# EAGLE design Qwiic LED Stick (EAGLE 9.0.1)
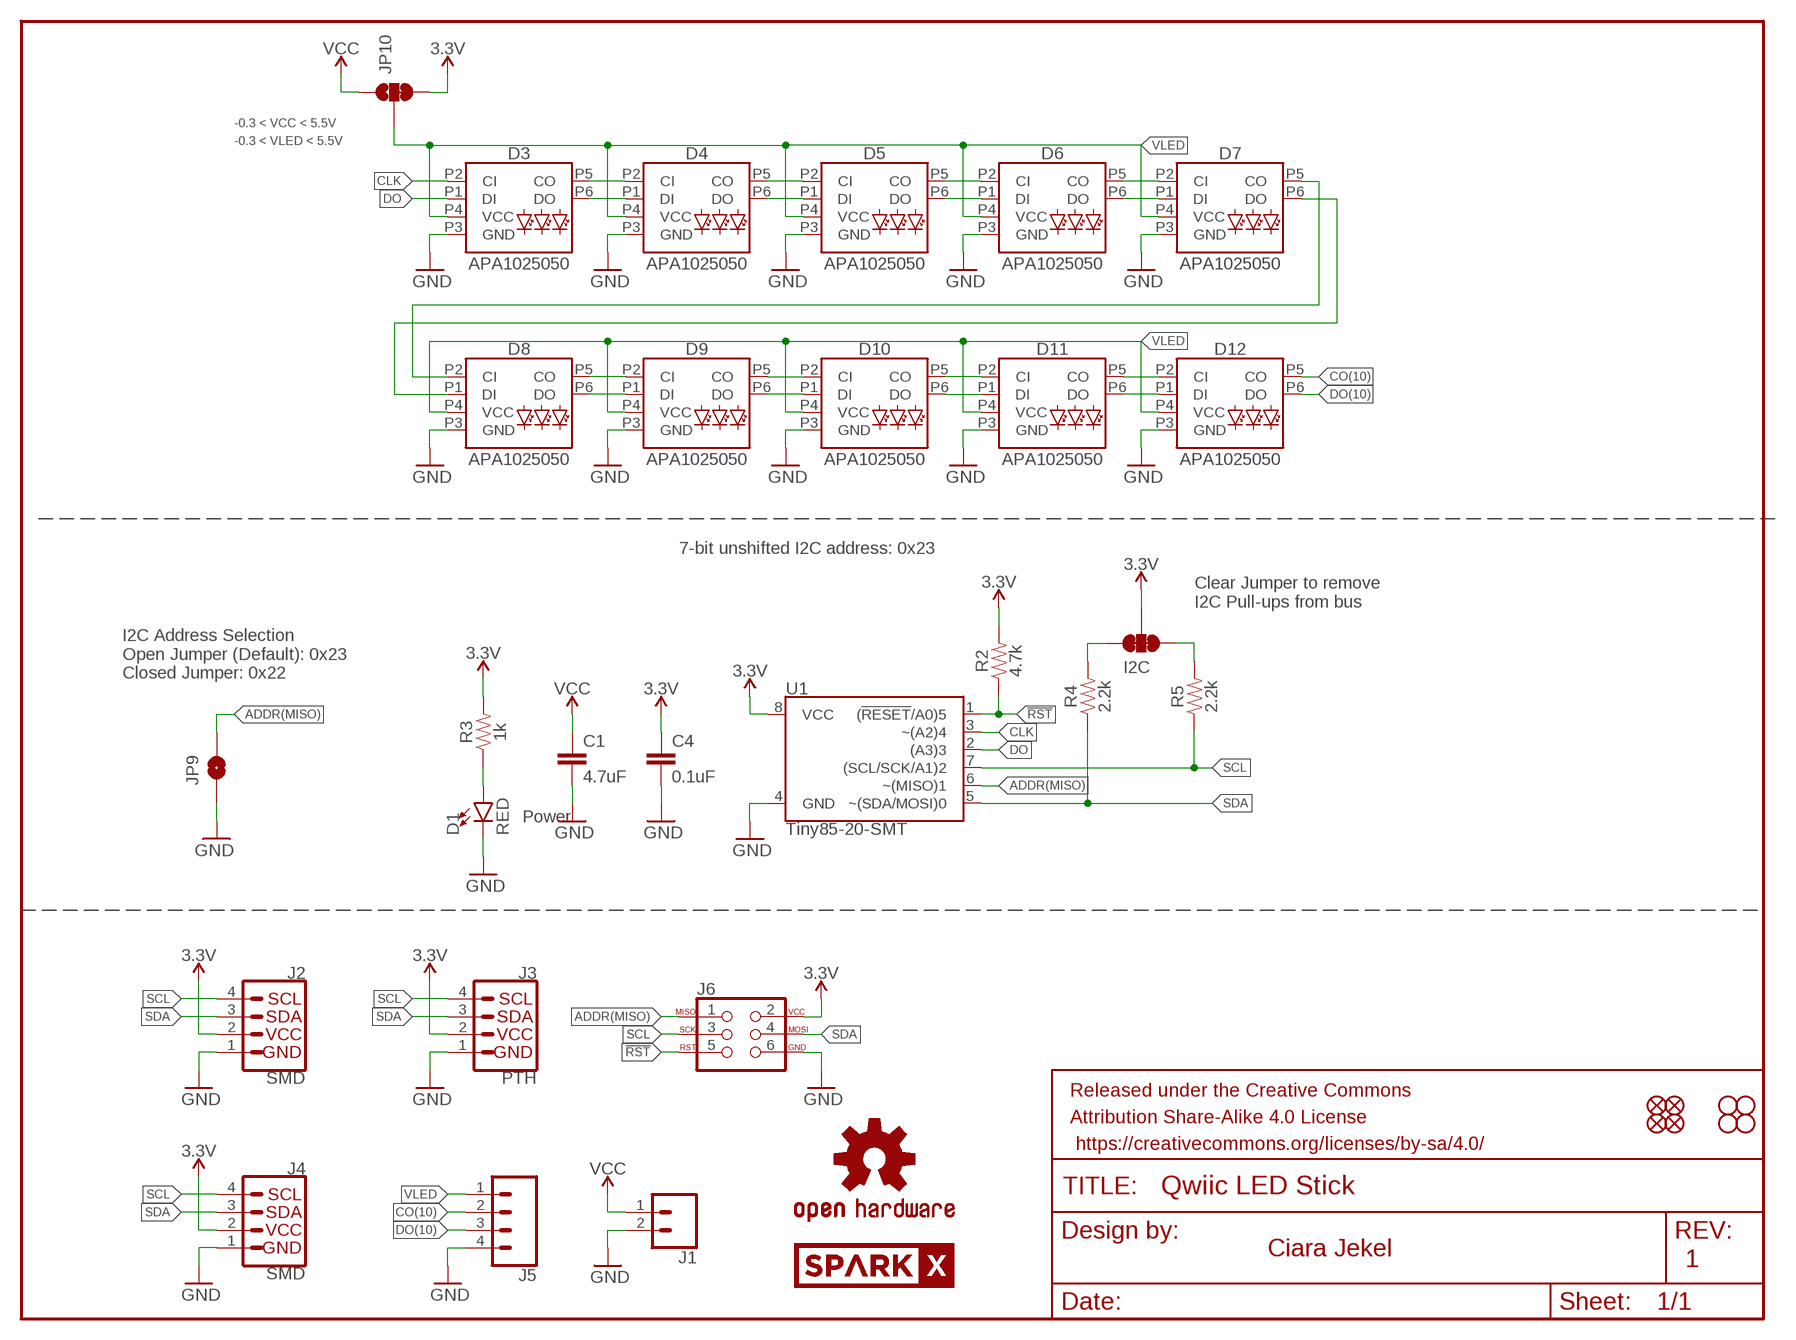
[diagram p0: schematic, sheet 1]

## Parts
C1  4.7uF  4.7UF-0603-6.3V-(10%)  [0603]
C4  0.1uF  0.1UF-0603-25V-(+80/-20%)  [0603]
D1  RED  LED-RED0603  [LED-0603]
D3  APA1025050  [APA102-5050]
D4  APA1025050  [APA102-5050]
D5  APA1025050  [APA102-5050]
D6  APA1025050  [APA102-5050]
D7  APA1025050  [APA102-5050]
D8  APA1025050  [APA102-5050]
D9  APA1025050  [APA102-5050]
D10  APA1025050  [APA102-5050]
D11  APA1025050  [APA102-5050]
D12  APA1025050  [APA102-5050]
FRAME1  FRAME-LETTER  [CREATIVE_COMMONS]
I2C  JUMPER-SMT_3_2-NC_TRACE_SILK  [SMT-JUMPER_3_2-NC_TRACE_SILK]
J1  CONN_021X02_NO_SILK  [1X02_NO_SILK]
J2  SMD  I2C_STANDARDJS-1MM  [1X04_1MM_RA]
J3  PTH  I2C_STANDARD_NO_SILK  [1X04_NO_SILK]
J4  SMD  I2C_STANDARDJS-1MM  [1X04_1MM_RA]
J5  CONN_041X04_NO_SILK  [1X04_NO_SILK]
J6  AVR_SPI_PROG_3X2TESTPOINTS  [2X3_TEST_POINTS]
JP1  FIDUCIALUFIDUCIAL  [MICRO-FIDUCIAL]
JP2  FIDUCIALUFIDUCIAL  [MICRO-FIDUCIAL]
JP3  STAND-OFF  [STAND-OFF]
JP4  STAND-OFF  [STAND-OFF]
JP5  FIDUCIALUFIDUCIAL  [MICRO-FIDUCIAL]
JP6  FIDUCIALUFIDUCIAL  [MICRO-FIDUCIAL]
JP7  STAND-OFF  [STAND-OFF]
JP8  STAND-OFF  [STAND-OFF]
JP9  JUMPER-SMT_2_NO_SILK  [SMT-JUMPER_2_NO_SILK]
JP10  JUMPER-SMT_3_1-NC_TRACE_SILK  [SMT-JUMPER_3_1-NC_TRACE_SILK]
LOGO1  OSHW-LOGOMINI  [OSHW-LOGO-MINI]
R2  4.7k  4.7KOHM-0603-1/10W-1%  [0603]
R3  1k  1KOHM-0603-1/10W-1%  [0603]
R4  2.2k  2.2KOHM-0603-1/10W-1%  [0603]
R5  2.2k  2.2KOHM-0603-1/10W-1%  [0603]
U1  Tiny85-20-SMT  ATTINY85-ARDUINOTINY85-20-SMT  [SO08-EIAJ_MCU]
U$1  SPARKX-LOGO4  [SPARKX-MEDIUM]
U$2  SPARKX-LOGO4  [SPARKX-MEDIUM]

## Nets
3.3V: C4.1 I2C.2 J2.2(VCC) J3.2(VCC) J4.2(VCC) J6.2 JP10.3 R2.2 R3.2 U1.8(VCC)
!RST: J6.5 R2.1 U1.1((!RESET!/A0)5)
ADDR(MISO): J6.1 JP9.2 U1.6(~(MISO)1)
CLK: D3.P2(CI) U1.3(~(A2)4)
CO(10): D12.P5(CO) J5.2
DO: D3.P1(DI) U1.2((A3)3)
DO(10): D12.P6(DO) J5.3
GND: C1.2 C4.2 D1.C D3.P3(GND) D4.P3(GND) D5.P3(GND) D6.P3(GND) D7.P3(GND) D8.P3(GND) D9.P3(GND) D10.P3(GND) D11.P3(GND) D12.P3(GND) J1.2 J2.1(GND) J3.1(GND) J4.1(GND) J5.4 J6.6 JP9.1 U1.4(GND)
N$1: I2C.1 R5.2
N$2: I2C.3 R4.2
N$3: D1.A R3.1
N$8: D11.P6(DO) D12.P1(DI)
N$9: D11.P5(CO) D12.P2(CI)
N$10: D10.P5(CO) D11.P2(CI)
N$11: D10.P6(DO) D11.P1(DI)
N$12: D9.P5(CO) D10.P2(CI)
N$13: D9.P6(DO) D10.P1(DI)
N$14: D8.P5(CO) D9.P2(CI)
N$15: D8.P6(DO) D9.P1(DI)
N$16: D7.P5(CO) D8.P2(CI)
N$17: D7.P6(DO) D8.P1(DI)
N$18: D6.P5(CO) D7.P2(CI)
N$19: D6.P6(DO) D7.P1(DI)
N$20: D5.P6(DO) D6.P1(DI)
N$21: D5.P5(CO) D6.P2(CI)
N$22: D4.P6(DO) D5.P1(DI)
N$23: D4.P5(CO) D5.P2(CI)
N$24: D3.P5(CO) D4.P2(CI)
N$25: D3.P6(DO) D4.P1(DI)
SCL: J2.4(SCL) J3.4(SCL) J4.4(SCL) J6.3 R5.1 U1.7((SCL/SCK/A1)2)
SDA: J2.3(SDA) J3.3(SDA) J4.3(SDA) J6.4 R4.1 U1.5(~(SDA/MOSI)0)
VCC: C1.1 J1.1 JP10.1
VLED: D3.P4(VCC) D4.P4(VCC) D5.P4(VCC) D6.P4(VCC) D7.P4(VCC) D8.P4(VCC) D9.P4(VCC) D10.P4(VCC) D11.P4(VCC) D12.P4(VCC) J5.1 JP10.2

## Notes on the sheet
- -0.3 < VCC < 5.5V
- -0.3 < VLED < 5.5V
- 7-bit unshifted I2C address: 0x23
- Clear Jumper to remove 
  I2C Pull-ups from bus
- I2C Address Selection
  Open Jumper (Default): 0x23
  Closed Jumper: 0x22
- Power
- Ciara Jekel
- 1

## Library data of the parts
C1 = SparkFun-Capacitors:4.7UF: 4.7µF ceramic capacitors A capacitor is a passive two-terminal electrical component used to store electrical energy temporarily in an electric field.; PROD_ID: CAP-08280
C4 = SparkFun-Capacitors:0.1UF: 0.1µF ceramic capacitors A capacitor is a passive two-terminal electrical component used to store electrical energy temporarily in an electric field.; PROD_ID: CAP-00810
D1 = SparkFun-LED:LED-RED: Red SMD LED Used in manufacturing of most products at SparkFun Packages: 0603 - SMD 0603 package [Product Link] <http://docs.avagotech.com/docs/AV02-0551EN> 0603 SMART - SMD 0603 SMART package ( more efficient and expensive)[Product Link] <http://www.osram-os.com/Graphics/XPic2/00077099_0.pdf> 1206 - SMD1206 package [Product Link] <https://www.sparkfun.com/datasheets/DevTools/LilyPad/Q150OVS4.pdff> SparkFun Products: Pro Mini 328 -5V <https://www.sparkfun.com/products/821> RedBoard <https://www.sparkfun.com/products/12757> IOIO-OTG <https://www.sparkfun.com/products/13613>; PROD_ID: DIO-00819
D3-D12 = SparkFun-LED:APA102: APA102 Addressable RGB LED Used in manufacturing of various products at SparkFun Packages: 5050 2020 SparkFun Products: SparkFun Lumenati Boards <https://www.sparkfun.com/categories/405>; PROD_ID: DIO-13739
FRAME1 = SparkFun-Aesthetics:FRAME-LETTER: Schematic Frame - Letter Standard 8.5x11 US Letter frame
I2C = SparkFun-Jumpers:JUMPER-SMT_3_2-NC_TRACE: Normally closed trace jumper (2 of 2 connections) This jumper has a trace between all three pads so they are normally closed (NC). Use a razor knife to open the connection(s). For best results follow the IPC guidelines for cutting traces: Cutout at least 0.063 mm (0.005 in). Remove all loose material to clean up the cut area. Seal the cut with an approved epoxy. Reapply solder to reclose the connection(s).
J1 = SparkFun-Connectors:CONN_02: Multi connection point. Often used as Generic Header-pin footprint for 0.1 inch spaced/style header connections On any of the 0.1 inch spaced packages, you can populate with these: Break Away Headers - Straight <https://www.sparkfun.com/products/116> (PRT-00116) Break Away Male Headers - Right Angle <https://www.sparkfun.com/products/553> (PRT-00553) Female Headers <https://www.sparkfun.com/products/115> (PRT-00115) Break Away Headers - Machine Pin <https://www.sparkfun.com/products/117> (PRT-00117) Break Away Female Headers - Swiss Machine Pin <https://www.sparkfun.com/products/743> (PRT-00743) For SCREWTERMINALS and SPRING TERMINALS visit here: Screw Terimnals on SparkFun.com <https://www.sparkfun.com/search/results?term=Screw+Terminals> (5mm/3.5mm/2.54mm spacing) This device is also useful as a general connection point to wire up your design to another part of your project. Our various solder wires solder well into these plated through hole pads. Hook-Up Wire - Assortment (Stranded, 22 AWG) <https://www.sparkfun.com/products/11375> (PRT-11375) Hook-Up Wire - Assortment (Solid Core, 22 AWG) <https://www.sparkfun.com/products/11367> (PRT-11367) View the entire wire category on our website here <https://www.sparkfun.com/categories/141> Special notes: Molex polarized connector foot print use with: PRT-08233 with associated crimp pins and housings. 2.54_SCREWTERM for use with PRT-10571. 3.5mm Screw Terminal footprints for PRT-08084 5mm Screw Terminal footprints for use with PRT-08432
J2-J4 = SparkX:I2C_STANDARD: SparkFun I2C Standard Pinout Header SparkFun has standardized on a pinout for all I2C based sensor breakouts. This pinout allows I2C boards to be plugged directly into the headers on Arduino Uno compatible boards, and to be daisy chained easily. Example SparkFun Products: SparkFun Atmospheric Sensor Breakout - BME280 <https://www.sparkfun.com/products/13676> SparkFun Altitude/Pressure Sensor Breakout - MPL3115A2 <https://www.sparkfun.com/products/11084> SparkFun TOF Range Finder Sensor - VL6180 <https://www.sparkfun.com/products/12785>
J5 = SparkFun-Connectors:CONN_04: Multi connection point. Often used as Generic Header-pin footprint for 0.1 inch spaced/style header connections On any of the 0.1 inch spaced packages, you can populate with these: Break Away Headers - Straight <https://www.sparkfun.com/products/116> (PRT-00116) Break Away Male Headers - Right Angle <https://www.sparkfun.com/products/553> (PRT-00553) Female Headers <https://www.sparkfun.com/products/115> (PRT-00115) Break Away Headers - Machine Pin <https://www.sparkfun.com/products/117> (PRT-00117) Break Away Female Headers - Swiss Machine Pin <https://www.sparkfun.com/products/743> (PRT-00743) For SCREWTERMINALS and SPRING TERMINALS visit here: Screw Terimnals on SparkFun.com <https://www.sparkfun.com/search/results?term=Screw+Terminals> (5mm/3.5mm/2.54mm spacing) This device is also useful as a general connection point to wire up your design to another part of your project. Our various solder wires solder well into these plated through hole pads. Hook-Up Wire - Assortment (Stranded, 22 AWG) <https://www.sparkfun.com/products/11375> (PRT-11375) Hook-Up Wire - Assortment (Solid Core, 22 AWG) <https://www.sparkfun.com/products/11367> (PRT-11367) View the entire wire category on our website here <https://www.sparkfun.com/categories/141> Special notes: Molex polarized connector foot print use with SKU : PRT-08231 with associated crimp pins and housings. 1MM SMD Version SKU: PRT-10208; PROD_ID: CONN-09696
J6 = SparkFun-Connectors:AVR_SPI_PROG_3X2: AVR ISP 6 Pin This is the reduced ISP connector for AVR programming. Common on Arduino. This footprint will take up less PCB space and can be used with a 10-pin to 6-pin adapter such as SKU: BOB-08508 **Special note about "TEST_POINT" package. The stop mask is on the top side, so if you want your programming test points to be on the bottom of your board, make sure to place this package on the bottom side of the board. This also ensure that the orientation to program from the bottom side will be correct. SparkFun Products: SparkFun ISP Pogo Adapter <https://www.sparkfun.com/products/11591> - NS Tiny AVR Programmer <https://www.sparkfun.com/products/11801> -PTH
JP1 JP2 JP5 JP6 = SparkFun:FIDUCIAL: Fiducial Alignment Points Various fiducial points for machine vision alignment.
JP3 JP4 JP7 JP8 = SparkFun:STAND-OFF: Stand Off This is the mechanical footprint for a #4 phillips button head screw. Use the keepout ring to avoid running the screw head into surrounding components. SKU : PRT-00447
JP9 = SparkFun-Jumpers:JUMPER-SMT_2_NO: Normally open jumper This jumper has two pads in close proximity to each other. Apply solder to close the connection. Round pads are easier to solder for beginners, but are a lot larger. SparkFun Product that uses the round pads: SparkFun EL Sequencer <https://www.sparkfun.com/products/12781>
JP10 = SparkFun-Jumpers:JUMPER-SMT_3_1-NC_TRACE: Normally closed trace jumper (1 of 2 connections) This jumper has a trace between two pads so it's normally closed (NC). The other connection is normally open (NO). Use a razor knife to open the connection. For best results follow the IPC guidelines for cutting traces: Cutout at least 0.063 mm (0.005 in). Remove all loose material to clean up the cut area. Seal the cut with an approved epoxy. Reapply solder to reclose the connection, or to close the NO connection.
LOGO1 = SparkFun-Aesthetics:OSHW-LOGO: Open-Source Hardware (OSHW) Logo This logo indicates the piece of hardware it is found on incorporates a OSHW license and/or adheres to the definition of open source hardware found here: http://freedomdefined.org/OSHW
R2 = SparkFun-Resistors:4.7KOHM: 4.7kΩ resistor A resistor is a passive two-terminal electrical component that implements electrical resistance as a circuit element. Resistors act to reduce current flow, and, at the same time, act to lower voltage levels within circuits. - Wikipedia; PROD_ID: RES-07857
R3 = SparkFun-Resistors:1KOHM: 1kΩ resistor A resistor is a passive two-terminal electrical component that implements electrical resistance as a circuit element. Resistors act to reduce current flow, and, at the same time, act to lower voltage levels within circuits. - Wikipedia; PROD_ID: RES-07856
R4 R5 = SparkFun-Resistors:2.2KOHM: 2.2kΩ resistor A resistor is a passive two-terminal electrical component that implements electrical resistance as a circuit element. Resistors act to reduce current flow, and, at the same time, act to lower voltage levels within circuits. - Wikipedia; PROD_ID: RES-08272
U1 = Qwiic-Bluetooth-HC1x:ATTINY85-ARDUINO: Atmel 8-pin 2/4/8kB flash uC; PROD_ID: IC-09092
U$1 U$2 = SparkX:SPARKX-LOGO

## Net classes
1 power: width 0.203 mm

## Board
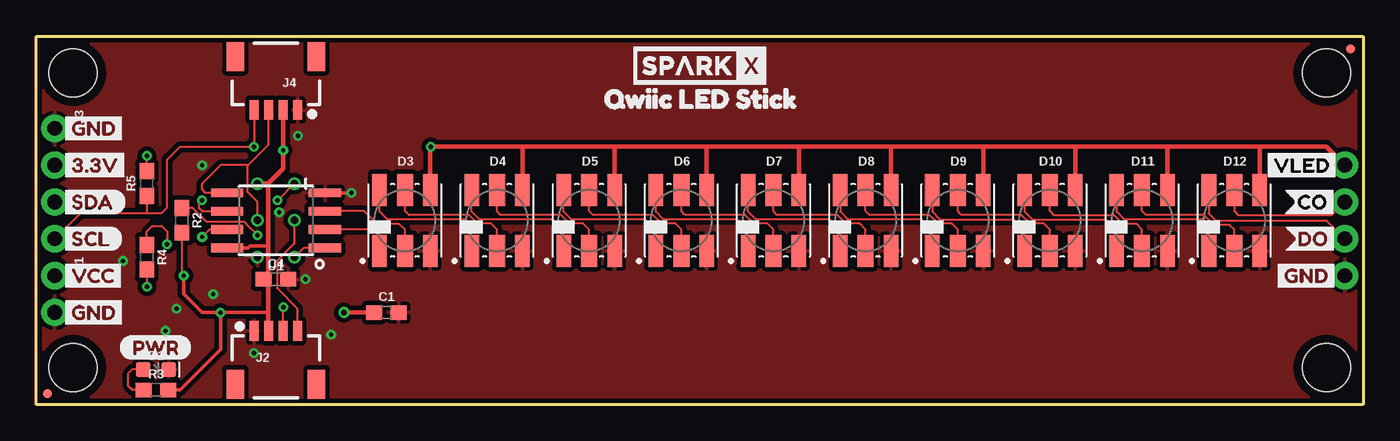
[diagram p1: board, top side]
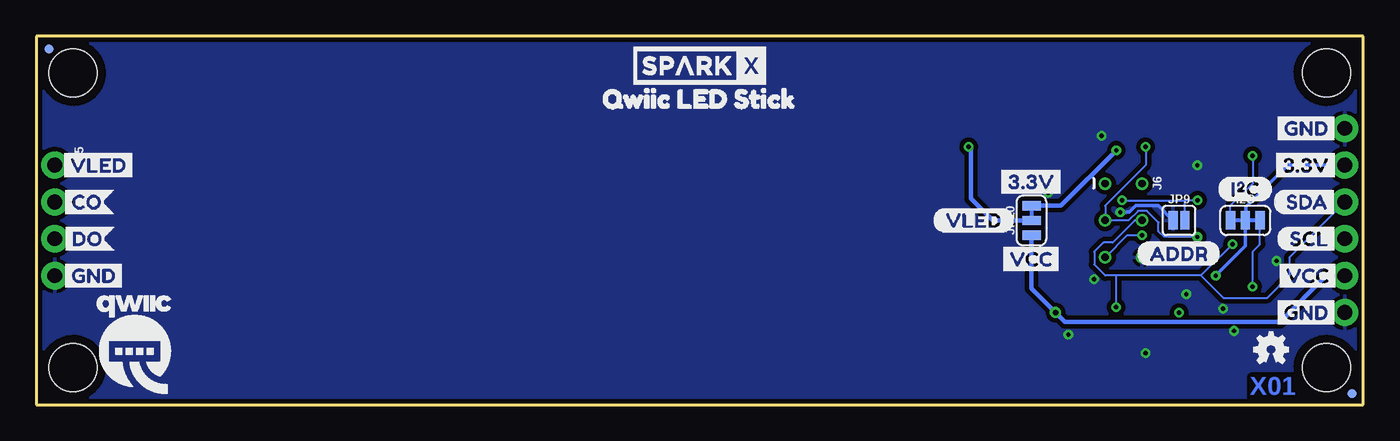
[diagram p2: board, bottom side, seen from below]

Size 91.44 x 25.4 mm. Coordinates in mm from the lower left corner, seen from the top.
Outline: 91.44,0 0,0 0,25.4 91.44,25.4 91.44,0
Copper layers (1*16): Top 0.035mm / dielectric 1.5mm / Bottom 0.035mm
Design rules "SparkFun-2-layer-PCBWay-LIMIT": minimum track width 6mil, minimum drill 0.3mm, track to track 6mil, track to pad 6mil, pad to pad 6mil, via to via 6mil, smd to smd 6mil, copper to edge 6mil, drill to drill 6mil, minimum pad ring 7mil, minimum via ring 7mil, stop-mask expansion 4mil, vias tented up to drill 25mil, thermal gap 10mil

### Footprints (pad centres in the part's own frame; a part is rotated, then mirrored left to right if it is on the bottom)
0603 = smd 1.1 x 1: 1 -0.85,0; 2 0.85,0
LED-0603 = smd 1 x 1: A -0.877,0; C 0.877,0
APA102-5050 = smd 1 x 2.2: P1 -1.75,-2.1; P3 1.75,-2.1; P4 1.75,2.1; P6 -1.75,2.1 | smd 1.1 x 2.2: P2 0,-2.1; P5 0,2.1
SMT-JUMPER_3_2-NC_TRACE_SILK = smd 0.635 x 1.27: 1 -1.016,0; 2 0,0; 3 1.016,0
1X02_NO_SILK = drill 1.016 pad 1.88: 1 0,0; 2 2.54,0
1X04_1MM_RA = smd 0.6 x 1.35: 1 -1.5,0; 2 -0.5,0; 3 0.5,0; 4 1.5,0 | smd 1.2 x 2: NC1 2.8,-3.675; NC2 -2.8,-3.675
1X04_NO_SILK = drill 1.016 pad 1.88: 1 0,0; 2 2.54,0; 3 5.08,0; 4 7.62,0
2X3_TEST_POINTS = drill 0.508: 1 -2.54,-1.27; 2 -2.54,1.27; 3 0,-1.27; 4 0,1.27; 5 2.54,-1.27; 6 2.54,1.27
MICRO-FIDUCIAL = smd 0.635 x 0.635: 1 0,0
STAND-OFF = hole 3.302: 0,0
SMT-JUMPER_2_NO_SILK = smd 0.635 x 1.27: 1 -0.406,0; 2 0.406,0
SMT-JUMPER_3_1-NC_TRACE_SILK = smd 0.635 x 1.27: 1 -1.016,0; 2 0,0; 3 1.016,0
SO08-EIAJ_MCU = smd 0.61 x 2.21: 1 -1.905,-3.378; 2 -0.635,-3.378; 3 0.635,-3.378; 4 1.905,-3.378; 5 1.905,3.353; 6 0.635,3.353; 7 -0.635,3.353; 8 -1.905,3.353

### Placement (x,y rotation side)
C1  24.13,6.35 0 top
C4  16.51,8.64 0 top
D1  8.26,2.41 0 top
D3  25.4,12.7 0 top
D4  31.75,12.7 0 top
D5  38.1,12.7 0 top
D6  44.45,12.7 0 top
D7  50.8,12.7 0 top
D8  57.15,12.7 0 top
D9  63.5,12.7 0 top
D10  69.85,12.7 0 top
D11  76.2,12.7 0 top
D12  82.55,12.7 0 top
FRAME1  10.16,-8.89 0 top  (outside the outline)
I2C  8.13,12.7 0 bottom
J1  1.27,8.89 270 top
J2  16.51,5.08 0 top
J3  1.27,19.05 270 top
J4  16.51,20.32 180 top
J5  90.17,16.51 270 bottom
J6  16.51,12.7 270 bottom
JP1  0.76,0.76 270 bottom
JP2  90.55,24.51 90 top
JP3  2.54,2.54 90 top
JP4  2.54,22.86 90 top
JP5  90.55,24.51 270 bottom
JP6  0.76,0.76 90 top
JP7  88.9,22.86 0 top
JP8  88.9,2.54 0 top
JP9  12.7,12.7 0 bottom
JP10  22.86,12.7 90 bottom
LOGO1  6.35,3.81 0 bottom
R2  10.03,12.7 270 top
R3  8.26,1.02 0 top
R4  7.62,10.16 270 top
R5  7.62,15.24 90 top
U1  16.51,12.7 90 top
U$1  45.72,23.37 0 top
U$2  45.72,23.37 0 bottom
U$3  [GND1]  6.35,19.05 0 bottom
U$4  [3#3V2]  6.48,16.51 0 bottom
U$5  [VLED4]  90.04,16.51 0 bottom
U$6  [DO8]  89.92,11.43 0 bottom
U$7  [CO5]  89.92,13.97 0 bottom
U$8  [GND1]  89.92,8.89 0 bottom
U$9  [VLED4]  84.33,16.51 0 top
U$10  [(PWR)]  5.71,3.94 0 top
U$11  [(I_SUPER2_C)]  10.03,14.86 0 bottom
U$12  [GND1]  85.09,8.89 0 top
U$13  [QWIIC_LED_STICK1]  53.59,21.08 0 bottom
U$15  [DO12]  85.98,11.43 0 top
U$16  [CO9]  85.98,13.97 0 top
U$17  [SDA0]  6.22,13.97 0 bottom
U$18  [SCL1]  5.97,11.43 0 bottom
U$19  [VCC1]  1.52,8.89 0 top
U$20  [VCC1]  6.22,8.89 0 bottom
U$21  [3#3V2]  1.52,16.51 0 top
U$22  [GND1]  1.52,19.05 0 top
U$23  [GND0]  6.35,6.35 0 bottom
U$24  [GND0]  1.52,6.35 0 top
U$25  [VLED3]  29.72,12.7 0 bottom
U$26  [SCL9]  1.52,11.43 0 top
U$27  [SDA8]  1.52,13.97 0 top
U$28  [ADDR2]  15.62,10.41 0 bottom
U$29  [QWIIC-LOGO-MEDIUM]  84.71,4.19 0 bottom
U$30  [3#3V3]  25.4,15.37 0 bottom
U$31  [VCC1]  25.27,10.03 0 bottom
U$32  [QWIIC_LED_STICK1]  37.97,21.08 0 top

### Tracks (layer width: path | path; a pad name or v marks a point on that pad's centre or on a via)
3.3V  (via drill 0.3)
  Top 0.152: R2.2 10.03,9.02 v10.16,8.89
  Top 0.254: J2.2 16.01,6.35 | 16.01,6.35 16.01,8.29 C4.1 16,8.98 16,10.92 14.73,10.92 14.61,10.79 U1.8 | v10.16,8.89 10.16,7.62 11.43,6.35 v12.7,6.35 | v12.7,6.35 16.01,6.35 | v12.7,6.35 12.7,3.81 9.91,1.02 R3.2
  Top 0.305: J4.2 v17.01,17.53 17.01,16.27 15.98,15.24 | J2.2 15.98,5.11 15.98,15.24 | 15.75,15.24 J6.2 15.98,15.24
  Bottom 0.152: 5.21,16.51 4.32,16.51
  Bottom 0.254: 4.7,16.51 4.32,16.51 J3.2 5.21,16.51 8.1,13.61 8.1,12.72 I2C.2 8.13,10.92 v10.16,8.89
  Bottom 0.305: JP10.3 20.82,13.72 v17.01,17.53
!RST  (via drill 0.3)
  Top 0.152: U1.1 18.41,10.79 J6.5 | R2.1 10.78,13.55 11.74,12.6 14.36,12.6 14.49,12.46 14.49,12.43 v15.24,11.68
  Bottom 0.152: J6.5 16.26,11.68 v15.24,11.68
ADDR(MISO)  (via drill 0.3)
  Top 0.152: U1.6 11.43,13.34 11.24,13.53 11.24,13.91 v11.42,14.08 | J6.1 v16.62,14.08
  Bottom 0.152: v16.62,14.08 12.32,14.08 | JP9.2 12.29,14.06 12.32,14.08 | v11.42,14.08 12.32,14.08
CLK
  Top 0.152: 23.5,12.45 25.02,12.45 25.4,12.06 D3.P2 | 23.5,12.45 | 23.5,12.45 22.61,13.34 U1.3
CO(10)
  Top 0.152: D12.P5 82.55,13.34 82.8,13.08 89.28,13.08 J5.2
DO
  Top 0.152: D3.P1 23.65,11.91 23.5,12.06 U1.2
DO(10)
  Top 0.152: D12.P6 80.8,13.18 81.28,12.7 88.9,12.7 J5.3
GND  (via drill 0.3)
  Top 0.254: U1.4 v21.72,14.61
  Bottom 0.254: v16.74,13.27 16.11,13.27 15.66,13.72 14.12,13.72 JP9.1
  other vias: 18.03,18.54 8.89,5.08 12.19,7.62 11.43,16.51 9.65,6.6 18.54,8.64 14.99,3.56 5.97,9.91 20.32,4.83
  pour Bottom (isolate 0.305): 91.44,0 0,0 0,25.4 91.44,25.4
  pour Top (isolate 0.305): 91.44,0 0,0 0,25.4 91.44,25.4
N$1  (via drill 0.3)
  Top 0.152: R5.2 v7.62,17.14
  Bottom 0.152: v7.62,17.14 7.62,15.24 9.14,13.72 I2C.1
N$2  (via drill 0.3)
  Top 0.152: R4.2 v7.62,8.13
  Bottom 0.152: v7.62,8.13 7.62,10.54 7.11,11.05 I2C.3
N$3
  Top 0.152: D1.A 6.6,2.41 6.35,2.16 6.35,1.27 6.6,1.02 R3.1
N$8
  Top 0.152: 74.42,14.77 D11.P6 74.45,13.31 74.98,12.78 80.34,12.78 80.8,12.32 D12.P1
N$9
  Top 0.152: D11.P5 76.2,13.34 76.45,13.08 80.5,13.08 80.5,13.05 81.15,12.39 82.22,12.39 82.55,12.06 D12.P2
N$10
  Top 0.152: D10.P5 69.85,13.34 70.1,13.08 74.25,13.08 74.86,12.47 75.79,12.47 76.2,12.06 D11.P2
N$11
  Top 0.152: D10.P6 68.1,13.31 68.63,12.78 73.71,12.78 74.42,12.06 74.42,10.63 D11.P1
N$12
  Top 0.152: D9.P5 63.5,13.34 63.75,13.08 67.89,13.08 68.5,12.47 69.44,12.47 69.85,12.06 D10.P2
N$13
  Top 0.152: D9.P6 61.75,13.31 62.28,12.78 67.36,12.78 68.1,12.04 D10.P1 68.1,11.15 68.07,11.18
N$14
  Top 0.152: D8.P5 57.15,13.34 57.4,13.08 61.55,13.08 62.16,12.47 63.09,12.47 63.5,12.06 D9.P2
N$15
  Top 0.152: D8.P6 55.4,13.31 55.93,12.78 61.01,12.78 61.75,12.04 D9.P1
N$16
  Top 0.152: D7.P5 50.8,13.34 51.05,13.08 55.2,13.08 55.8,12.47 56.74,12.47 57.15,12.06 D8.P2
N$17
  Top 0.152: D7.P6 49.05,13.31 49.58,12.78 54.66,12.78 55.4,12.04 D8.P1
N$18
  Top 0.152: D6.P5 44.45,13.34 44.7,13.08 48.84,13.08 49.45,12.47 50.39,12.47 50.8,12.06 D7.P2
N$19
  Top 0.152: D6.P6 42.7,13.31 43.23,12.78 48.31,12.78 49.02,12.06 49.02,11.46 49.05,11.43 D7.P1
N$20
  Top 0.152: D5.P6 36.35,13.31 36.88,12.78 41.96,12.78 42.7,12.04 D6.P1
N$21
  Top 0.152: D5.P5 38.1,13.34 38.35,13.08 42.49,13.08 43.1,12.47 44.04,12.47 44.45,12.06 D6.P2
N$22
  Top 0.152: D4.P6 30,13.31 30.53,12.78 35.61,12.78 36.35,12.04 D5.P1
N$23
  Top 0.152: D4.P5 31.75,13.34 32,13.08 36.15,13.08 36.76,12.47 37.69,12.47 38.1,12.06 D5.P2
N$24
  Top 0.152: D3.P5 25.4,13.34 25.68,13.06 29.82,13.06 30.41,12.47 31.34,12.47 31.75,12.06 D4.P2
N$25
  Top 0.152: D3.P6 23.65,13.31 24.21,12.75 29.54,12.75 29.97,12.32 29.97,11.46 30,11.43 D4.P1
SCL  (via drill 0.3)
  Top 0.152: J4.4 15.01,17.8 v14.99,17.78 9.91,17.78 9.02,16.89 9.02,13.59 8.64,13.21 7.62,13.21 | J6.3 17.78,11.09 16.58,9.89 16.58,8.04 18.01,6.61 J2.4 | U1.7 11.94,12.06 v11.43,11.56 | R5.1 7.62,13.21 | J3.4 3.05,13.21 7.62,13.21
  Bottom 0.152: v14.99,17.78 14.99,16.51 17.78,13.72 J6.3 16.17,12.7 15.51,13.36 14.91,13.36 14.11,12.56 | 14.1,12.55 14.11,12.56 | v11.43,11.56 13.72,11.56 14.11,11.95 14.11,12.56
SDA  (via drill 0.3)
  Top 0.152: U1.5 11.68,14.61 11.43,14.86 11.43,15.24 12.7,16.51 14.55,16.51 | J4.3 16.01,17.91 14.61,16.51 14.55,16.51 | J2.3 v17.01,6.72 v17.02,6.73 | R4.1 7.62,11.93 8,12.31 8,12.32 8.64,12.32 9.02,11.94 v9.02,11.05 | J6.4 15.24,13.97 14.55,14.66 14.55,16.51
  Bottom 0.152: 11.18,8.89 v9.02,11.05 | 11.18,8.89 9.65,7.37 6.6,7.37 5.08,8.89 5.08,10.16 J3.3 | J6.4 15.74,12.7 17.27,11.18 17.91,11.18 18.54,10.54 18.54,9.65 17.78,8.89 17.02,8.89 | 11.18,8.89 17.02,8.89 | v17.02,6.73 17.02,8.89
VCC  (via drill 0.38)
  Top 0.305: C1.1 v21.21,6.35
  Bottom 0.305: J1.1 2.54,8.89 5.71,5.71 20.57,5.71 v21.21,6.35 22.86,8 JP10.1
VLED  (via drill 0.3)
  Top 0.152: D9.P4 65.28,14.83 | D10.P4 71.63,14.83 | D8.P4 58.93,14.83 | D7.P4 52.58,14.83
  Top 0.305: D3.P4 27.15,17.75 v27.18,17.78 33.5,17.78 | 33.5,17.78 39.85,17.78 | 39.85,17.78 46.2,17.78 | 46.2,17.78 52.55,17.78 | 52.55,17.78 58.9,17.78 | 58.9,17.78 65.25,17.78 | 65.25,17.78 71.6,17.78 | 71.6,17.78 77.95,17.78 | D11.P4 77.95,17.78 | D10.P4 71.6,17.78 | D9.P4 65.25,17.78 | D8.P4 58.9,17.78 | D7.P4 52.55,17.78 | D6.P4 46.2,17.78 | D5.P4 39.85,17.78 | D4.P4 33.5,17.78 | 77.95,17.78 84.3,17.78 | D12.P4 84.3,17.78 | J5.1 88.9,17.78 84.3,17.78
  Bottom 0.305: JP10.2 25.53,12.7 27.05,14.22 27.05,17.65 v27.18,17.78

### Text on the board
Bottom: X01
Measures: Units in Inches
tDocu: Ciara Jekel